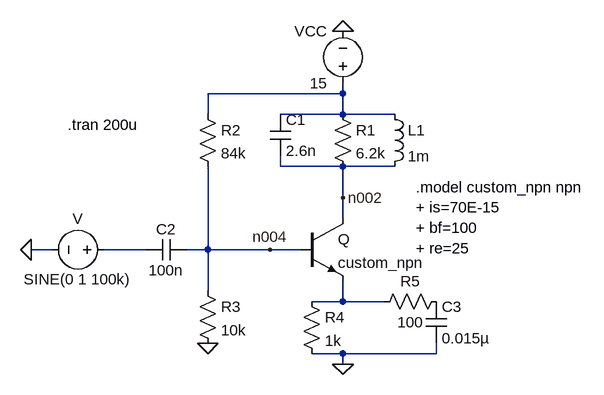
[diagram p0: schematic c02ex16s01.asc]
c02ex16s01.asc, the LTspice schematic file:
Version 4
SHEET 1 880 680
WIRE 256 128 256 112
WIRE 256 128 48 128
WIRE 48 160 48 128
WIRE 256 160 256 128
WIRE 256 160 160 160
WIRE 336 160 256 160
WIRE 160 240 160 224
WIRE 256 240 160 240
WIRE 336 240 256 240
WIRE 256 288 256 240
WIRE 256 320 256 288
WIRE -192 368 -224 368
WIRE -48 368 -112 368
WIRE 48 368 48 240
WIRE 48 368 16 368
WIRE 144 368 48 368
WIRE 192 368 144 368
WIRE 48 432 48 368
WIRE 256 448 256 416
WIRE 256 448 208 448
WIRE 320 448 256 448
WIRE 256 528 208 528
WIRE 400 528 400 512
WIRE 400 528 256 528
WIRE 256 544 256 528
FLAG 256 544 0
FLAG 256 32 0
FLAG -224 368 0
FLAG 48 512 0
FLAG 144 368 n004
FLAG 256 288 n002
SYMBOL voltage -96 368 R90
WINDOW 0 -32 56 VBottom 2
WINDOW 3 61 57 VBottom 2
WINDOW 123 0 0 Left 0
WINDOW 39 0 0 Left 0
SYMATTR InstName V
SYMATTR Value SINE(0 1 100k)
SYMBOL npn 192 320 R0
SYMATTR InstName Q
SYMATTR Value custom_npn
SYMBOL voltage 256 128 R180
WINDOW 0 24 96 Left 2
WINDOW 3 24 16 Left 2
WINDOW 123 0 0 Left 0
WINDOW 39 0 0 Left 0
SYMATTR InstName VCC
SYMATTR Value 15
SYMBOL ind 320 144 R0
SYMATTR InstName L1
SYMATTR Value 1m
SYMBOL res 240 144 R0
SYMATTR InstName R1
SYMATTR Value 6.2k
SYMBOL cap 144 160 R0
SYMATTR InstName C1
SYMATTR Value 2.6n
SYMBOL res 32 144 R0
SYMATTR InstName R2
SYMATTR Value 84k
SYMBOL res 32 416 R0
SYMATTR InstName R3
SYMATTR Value 10k
SYMBOL cap 16 352 R90
WINDOW 0 0 32 VBottom 2
WINDOW 3 32 32 VTop 2
SYMATTR InstName C2
SYMATTR Value 100n
SYMBOL res 192 432 R0
SYMATTR InstName R4
SYMATTR Value 1k
SYMBOL res 416 432 R90
WINDOW 0 0 56 VBottom 2
WINDOW 3 32 56 VTop 2
SYMATTR InstName R5
SYMATTR Value 100
SYMBOL cap 384 448 R0
SYMATTR InstName C3
SYMATTR Value 0.015µ
SYMATTR SpiceLine V=50 Irms=0 Rser=0.067 Lser=730p mfg="Würth Elektronik" pn="885012210020 WCAP-CSGP 1812" type="X7R"
TEXT -168 176 Left 2 !.tran 200u
TEXT 368 272 Left 2 !.model custom_npn npn\n+ is=70E-15\n+ bf=100\n+ re=25

The netlist it stands for:
* c02ex16s01.asc
V N003 0 SINE(0 1 100k)
Q n002 n004 N005 0 custom_npn
VCC N001 0 15
L1 N001 n002 1m
R1 N001 n002 6.2k
C1 N001 n002 2.6n
R2 N001 n004 84k
R3 n004 0 10k
C2 n004 N003 100n
R4 N005 0 1k
R5 P001 N005 100
C3 P001 0 0.015µ V=50 Irms=0 Rser=0.067 Lser=730p mfg="Würth Elektronik" pn="885012210020 WCAP-CSGP 1812" type="X7R"
.model NPN NPN
.model PNP PNP
.lib standard.bjt
.tran 200u
.model custom_npn npn
+ is=70E-15
+ bf=100
+ re=25
.backanno
.end